# Altium schematic sheet Power2.SchDoc: Titel
size A3; ApprovedBy: name; CompanyName: DCI Electronics bv; DrawnBy: KRS; Address1: Nijverheidsstraat 14; Address2: 4458 AV Eindewege; Address3: Phone: +31 (0)113 344880; DocumentNumber: 7; Revision: 1; SheetNumber: 7; SheetTotal: 14; PageSetup: Record=PageOptions|CenterHorizontal=True|CenterVertical=True|PrintScale=1.00|XCorrection=1.00|YCorrection=1.00|PrintKind=1|BorderSize=5000000|LeftOffset=0|BottomOffset=0|Orientation=2|PaperLength=1000|PaperWidth=1000|Scale=100|PaperSource=7|PrintQuality=-4|MediaType=1|DitherType=10|PaperKind=ISO_A4_(210.00_x_297.00_MM)|PrintScaleMode=1; SubTitle: SubTitel; ApprovedDate: 01-01-12; DesignedBy: KRS
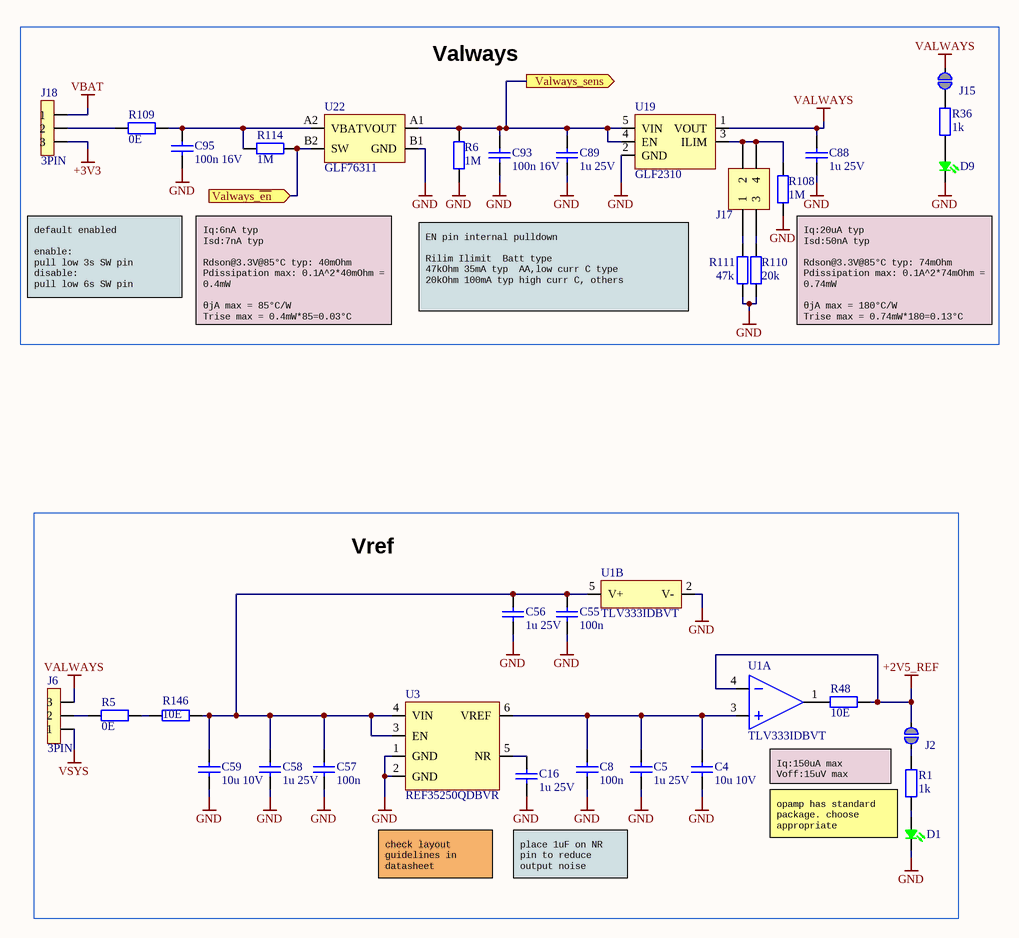
[diagram p0: Power2.SchDoc]

## Parts
C4  10u 10V  [CAPC1608X09N]
C5  1u 25V  [CAPC1608X09N]
C8  100n  [CAPC1608X09N]
C16  1u 25V  [CAPC1608X09N]
C55  100n  [CAPC1608X09N]
C56  1u 25V  [CAPC1608X09N]
C57  100n  [CAPC1608X09N]
C58  1u 25V  [CAPC1608X09N]
C59  10u 10V  [CAPC1608X09N]
C88  1u 25V  [CAPC1608X09N]
C89  1u 25V  [CAPC1608X09N]
C93  100n 16V  [CAPC1005X05N]
C95  100n 16V  [CAPC1005X05N]
D1  (no value)  [LED_0603_ANODE]
D9  (no value)  [LED_0603_ANODE]
J2  Solderbridge - Normally Open  [Solderbridge NO]  (value not drawn)  (no BOM)
J6  3PIN  [CON-003G001-003]
J15  Solderbridge - Normally Open  [Solderbridge NO]  (value not drawn)  (no BOM)
J17  2X2PIN  [CON-003G000-004]  (value not drawn)
J18  3PIN  [CON-003G001-003]
R1  1k  [RESC1608X13N]
R5  0E  [RESC1005X04N]
R6  1M  [RESC1005x04N]
R36  1k  [RESC1608X13N]
R48  10E  [RESC1608X13N]
R108  1M  [RESC1005x04N]
R109  0E  [RESC1005X04N]
R110  20k  [RESC1608X13N]
R111  47k  [RESC1608X13N]
R114  1M  [RESC1005x04N]
R146  10E  [RESC1608X13N]
U1  TLV333IDBVT  [SOT95P300X145-5N]  (parts A,B of 2)
U3  REF35250QDBVR  [SOT95P300X145-6N]
U19  GLF2310  [SOT95P280X115-5N]
U22  GLF76311  [BGA4C50P2X2_97X97X55]

## Blocks framed on the sheet
Valways: C88 C89 C93 C95 D9 J15 J17 J18 R6 R36 R108-R111 R114 U19 U22
Vref: C4 C5 C8 C16 C55-C59 D1 J2 J6 R1 R5 R48 R146 U1 U3

## Ports
Valways_sens (out), Valways_~{en} (in)

## Nets
+2V5_REF: J2.2 R48.2 U1.4(IN-)
+3V3: J18.3
GND: C4.1 C5.1 C8.1 C16.1 C55.1 C56.1 C57.1 C58.1 C59.1 C88.1 C89.1 C93.1 C95.1 D1.C D9.C R6.2 R108.1 R110.1 R111.1 U1.2(V-) U3.1(GND) U3.2(GND) U19.2(GND) U22.B1(GND)
VALWAYS: C88.2 J6.3 J15.2 U19.1(VOUT)
VBAT: J18.1
VSYS: J6.1
Valways_~{en}: R114.1 U22.B2(SW) ; port Valways_~{en}
Valways_sens: C89.2 C93.2 R6.1 U19.4(EN) U19.5(VIN) U22.A1(VOUT) ; port Valways_sens
NetC4_2: C4.2 C5.2 C8.2 U1.3(IN+) U3.6(VREF)
NetC16_2: C16.2 U3.5(NR)
NetC55_2: C55.2 C56.2 C57.2 C58.2 C59.2 R146.2 U1.5(V+) U3.3(EN) U3.4(VIN)
NetC95_2: C95.2 R109.2 R114.2 U22.A2(VBAT)
NetD1_A: D1.A R1.2
NetD9_A: D9.A R36.2
NetJ2_1: J2.1 R1.1
NetJ6_2: J6.2 R5.1
NetJ15_1: J15.1 R36.1
NetJ17_1: J17.1 R111.2
NetJ17_2: J17.2 J17.4 R108.2 U19.3(ILIM)
NetJ17_3: J17.3 R110.2
NetJ18_2: J18.2 R109.1
NetR5_2: R5.2 R146.1
NetR48_1: R48.1 U1.1(OUT)

## Notes on the sheet
- default enabled
  enable:
  pull low 3s SW pin
  disable:
  pull low 6s SW pin
- Iq:6nA typ
  Isd:7nA typ
  Rdson@3.3V@85°C typ: 40mOhm
  Pdissipation max: 0.1A^2*40mOhm = 0.4mW
  θjA max = 85°C/W
  Trise max = 0.4mW*85=0.03°C
- EN pin internal pulldown
  Rilim	Ilimit		Batt type
  47kOhm	35mA typ		AA,low curr C type
  20kOhm	100mA typ	high curr C, others
- (near R108) Iq:20uA typ
  Isd:50nA typ
  Rdson@3.3V@85°C typ: 74mOhm
  Pdissipation max: 0.1A^2*74mOhm = 0.74mW
  θjA max = 180°C/W
  Trise max = 0.74mW*180=0.13°C
- Iq:150uA max
  Voff:15uV max
- opamp has standard package. choose appropriate
- check layout guidelines in datasheet
- place 1uF on NR pin to reduce output noise
- Designed by:
- Drawing number:
- Variant:
- Date:
- Page:
- Rev:
- Of:
- Dekimo Goes B.V.
- Nijverheidsstraat 14, 4458 AV  Eindewege, Phone: +31 (0)113 344880

## Library data of the parts
C4 C59 = CKE 10UV10/60: 10uF 10V ±20% X7T; EngPartGrpMainCode: CAP; ManufactpartCode: GRM188D71A106MA73D-MUR; Type: Capacitor ceramic SMD; Preferred: False; SMD_Flag: True; PartCode: CKE 10UV10/60
C5 C16 C56 C58 C88 C89 = CKE 1U/61: 1UF, 25V, 10%, 0603, X7R; EngPartGrpMainCode: CAP; ManufactpartCode: CL10B105KA8NNNC-SAM; Type: Capacitor ceramic SMD; Preferred: False; SMD_Flag: True; PartCode: CKE 1U/61
C8 C55 C57 = CKE 100N/60: 100nF 50V 10% X7R; EngPartGrpMainCode: CAP; ManufactpartCode: 2238 586 15649-PHI; Type: Capacitor ceramic SMD; Preferred: False; SMD_Flag: True; PartCode: CKE 100N/60
C93 C95 = CKE 100N/70: 100nF, 16V, 10%, X7R; EngPartGrpMainCode: CAP; ManufactpartCode: CC0402KRX7R7BB104-YAG; Type: Capacitor ceramic SMD; Preferred: False; SMD_Flag: True; PartCode: CKE 100N/70
D1 D9 = LED SMDG/16: Led Groen 0603; EngPartGrpMainCode: OPTO; ManufactpartCode: 150060VS75003-WE; Type: LED SMD; Preferred: False; SMD_Flag: True; PartCode: LED SMDG/16
J2 J15 = SolderbridgeNO: Solderbridge  - Normally Open
J6 J18 = CON PHDR1X3S/11: pinh 1x3/straight/Au/1.27pitch; EngPartGrpMainCode: CONN; ManufactpartCode: M50-3630342-HAR; Preferred: False; SMD_Flag: True; PartCode: CON PHDR1X3S/11; Type: Connector pinhdr SMD
J17 = CON PHDR2X2S/11: pinh 2x2/straight/Au/1.27pitch; EngPartGrpMainCode: CONN; ManufactpartCode: GRPB022VWQS-RC-SUL; Preferred: False; SMD_Flag: True; PartCode: CON PHDR2X2S/11; Type: Connector pinhdr SMD
R1 R36 = R 1K/60: 1K, 100mW, 1%; PartCode: R 1K/60; EngPartGrpMainCode: RES; ManufactpartCode: RC0603FR-071KL-YAG; Preferred: True; Type: Resistor metalfilm SMD; SMD_Flag: True
R5 R109 = R 0E/70: 0E, 62.5mW, 1%; PartCode: R 0E/70; EngPartGrpMainCode: RES; ManufactpartCode: RC0402JR-070RL-YAG; Preferred: False; SMD_Flag: True; Type: Resistor metalfilm SMD
R6 R108 R114 = R 1M/70: 1M, 62.5mW, 1%; PartCode: R 1M/70; EngPartGrpMainCode: RES; ManufactpartCode: RC0402FR-071ML-YAG; Preferred: False; SMD_Flag: True; Type: Resistor metalfilm SMD
R48 R146 = R 10E/60: 10E 0.1W 1%; EngPartGrpMainCode: RES; ManufactpartCode: RC0603FR-0710RL-YAG; Preferred: False; SMD_Flag: True; PartCode: R 10E/60; Type: Resistor metalfilm SMD
R110 = R 20K/60: 20k 100mW, 1%; EngPartGrpMainCode: RES; ManufactpartCode: RC0603FR-0720KL-YAG; Preferred: False; SMD_Flag: True; PartCode: R 20K/60; Type: Resistor metalfilm SMD
R111 = R 47K/60: 47k 100mW 1%; EngPartGrpMainCode: RES; ManufactpartCode: RC0603FR-0747KL-YAG; Preferred: False; SMD_Flag: True; PartCode: R 47K/60; Type: Resistor metalfilm SMD
U1 = IC TLV333/SOT: Op-Amp zero drift; EngPartGrpMainCode: IC; ManufactpartCode: TLV333IDBVT-TI; Preferred: False; SMD_Flag: True; PartCode: IC TLV333/SOT; Type: IC OpAmp SMD
U3 = IC REF35250QDBV: REF35250QDBVR, 2,5V; EngPartGrpMainCode: IC; ManufactpartCode: REF35250QDBVR-TI; Preferred: False; SMD_Flag: True; PartCode: IC REF35250QDBV; Type: IC voltage reference SMD
U19 = IC GLF2310A-T1: load sw adj current limit 5.5V; EngPartGrpMainCode: IC; ManufactpartCode: GLF2310A-T1G7-GLF; Preferred: False; SMD_Flag: True; PartCode: IC GLF2310A-T1; Type: IC switch SMD
U22 = IC GLF76311: Smart load sw, 2A, 5.5V; EngPartGrpMainCode: IC; ManufactpartCode: GLF76311-GLF; Preferred: False; SMD_Flag: True; PartCode: IC GLF76311; Type: IC switch SMD